# Altium schematic sheet Fuente.SchDoc
size A4
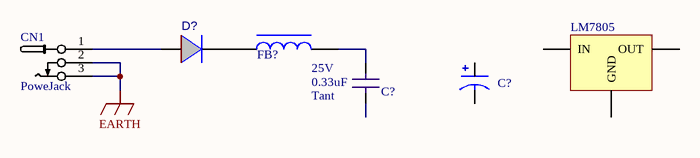
[diagram p0: Fuente.SchDoc]

## Parts
(Parts that share a designator on the sheet are numbered #1, #2 ... from top to bottom, then left to right.)
C?#1  C  [0805]  (value not drawn)
C?#2  C: 0.33uF  V: 25V  Material: Tant  [0805]  (hidden comment: Cap1)
CN1  PoweJack
D?  (no value)  [D_SMA]
FB?  Ferrite Bead  (value not drawn)
LM7805  Regulador  (value not drawn)

## Nets
EARTH: CN1.2 CN1.3
NetC?#2_1: C?#2.1 FB?.2
NetCN1_1: CN1.1 D?.1(A)
NetD?_2: D?.2(K) FB?.1

Not connected (* = marked no-connect by the designer): C?#1 1 2; C?#2 2; LM7805 1(IN) 2(GND) 3(OUT)

## Library data of the parts
C?#1 = Cap_Elec: Capacitor; Material: *; Part number: *
C?#2 = Cap1: Capacitor
CN1 = Barrel_jack
D? = DIODO: Diode signal
LM7805 = LM7805